# Altium schematic sheet MAIN.SchDoc
size OrCAD C
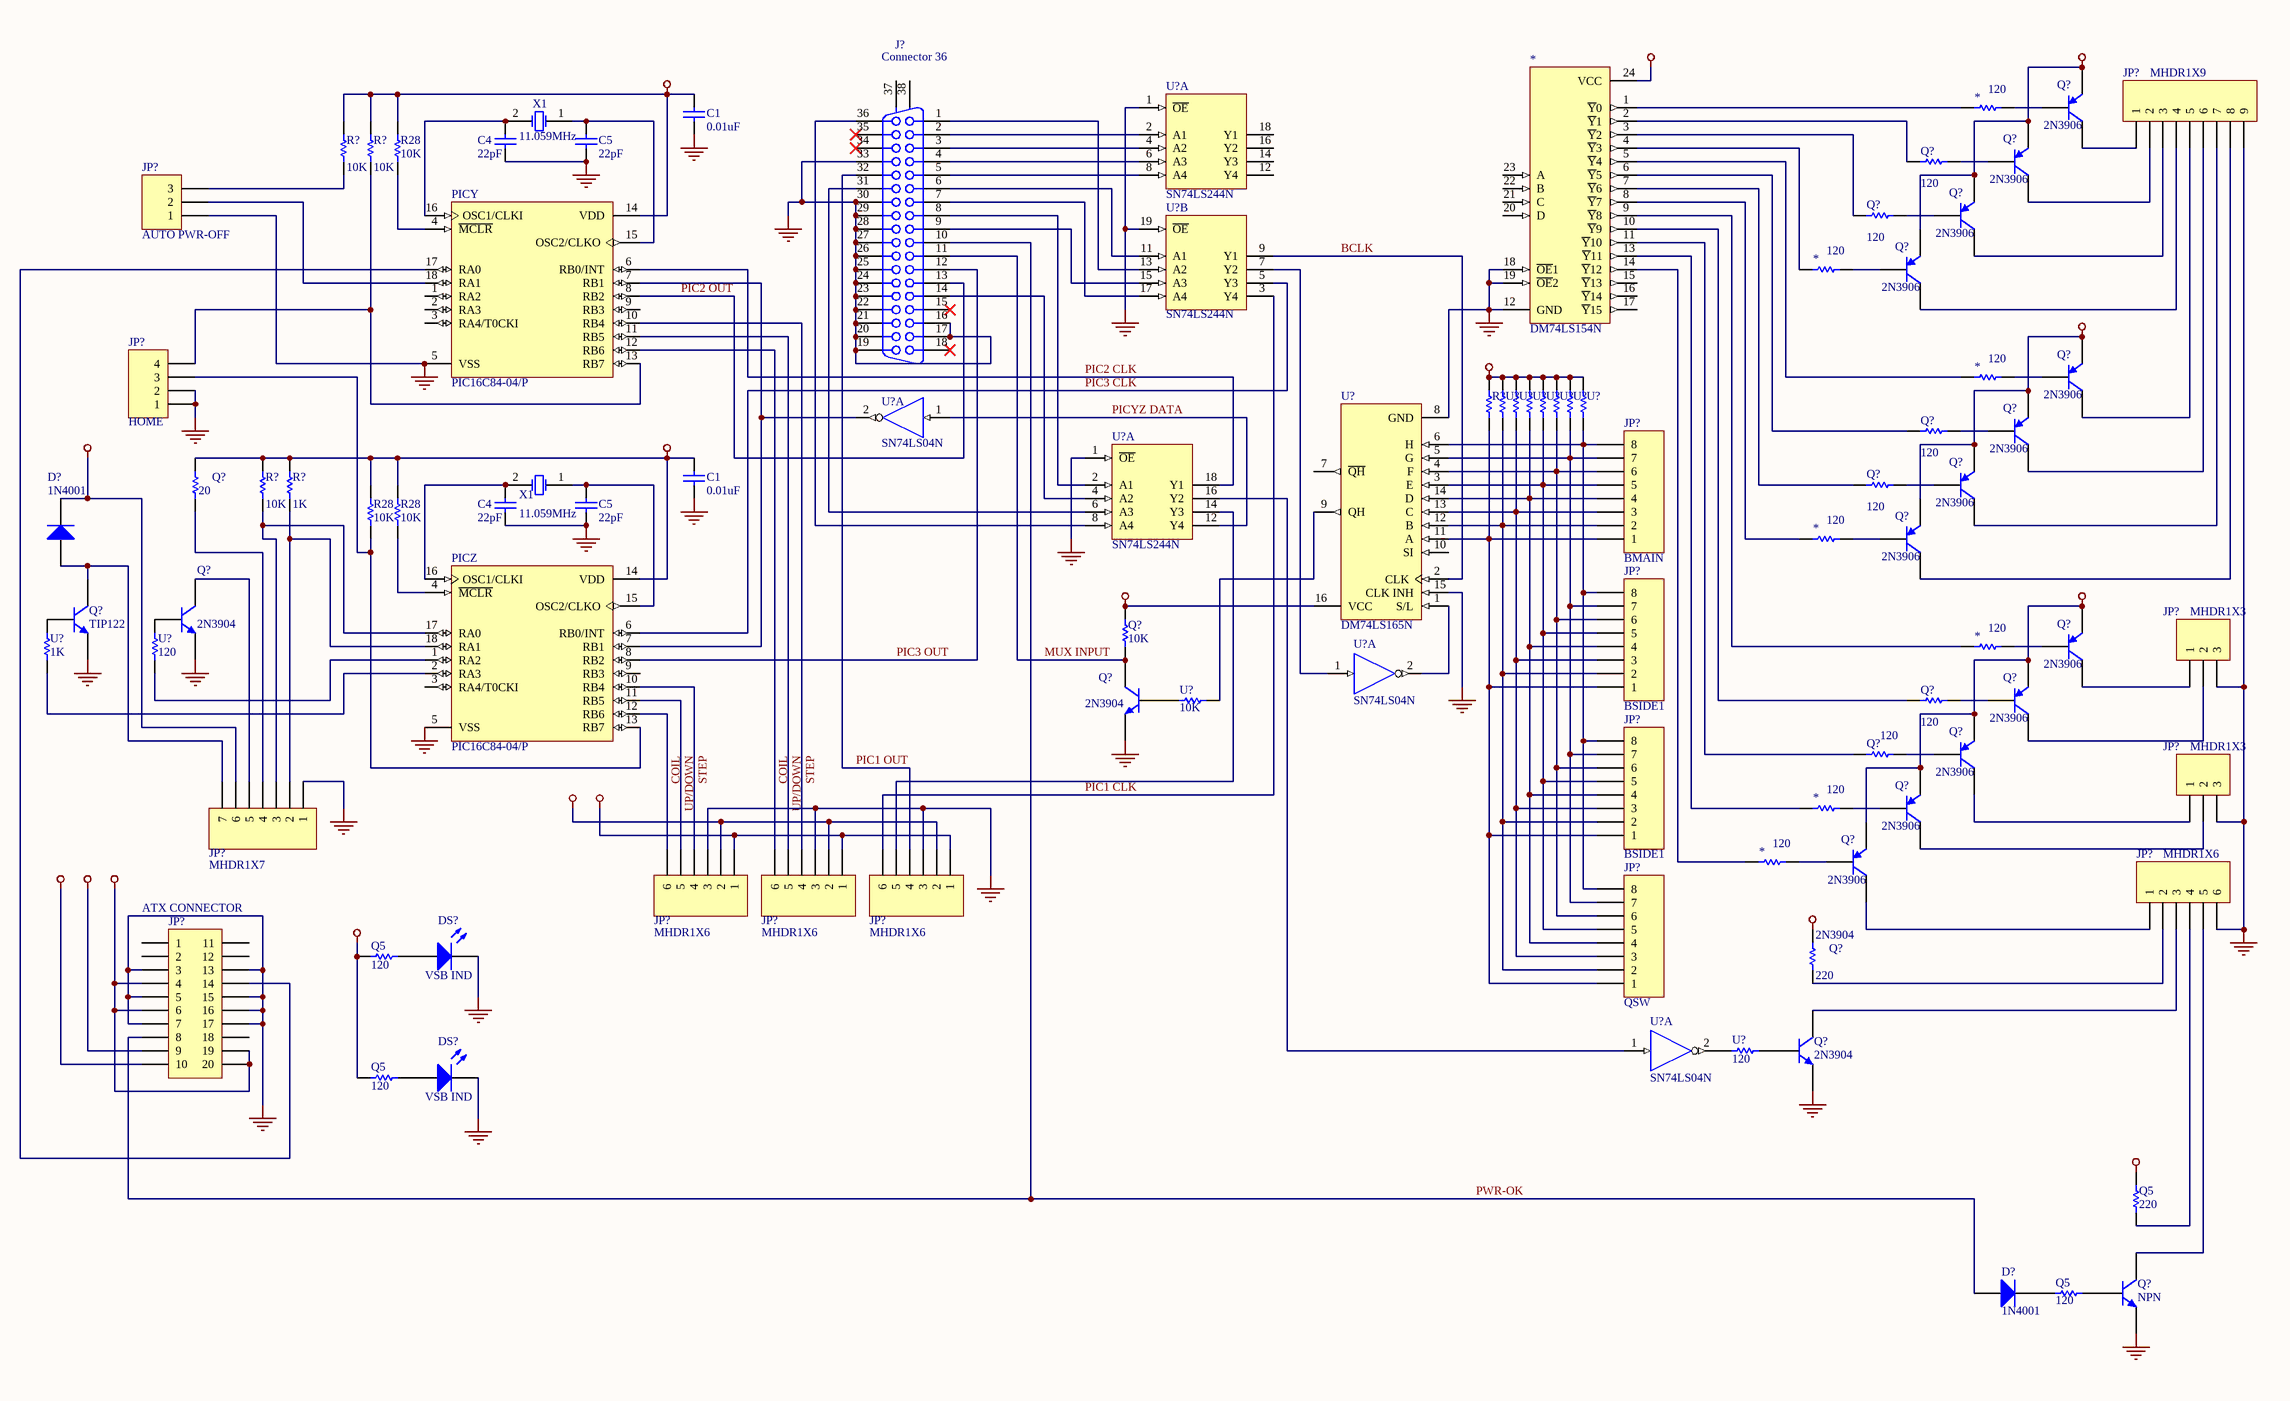
[diagram p0: MAIN.SchDoc]

## Parts
(Parts that share a designator on the sheet are numbered #1, #2 ... from top to bottom, then left to right.)
*#1  DM74LS154N  [DIP-16/X1.5]
*#2  value 120  [DIP-16/X1.5]  (hidden comment: SN74LS161AN)
*#3  value 120  [DIP-16/X1.5]  (hidden comment: SN74LS161AN)
*#4  value 120  [DIP-16/X1.5]  (hidden comment: SN74LS161AN)
*#5  value 120  [DIP-16/X1.5]  (hidden comment: SN74LS161AN)
*#6  value 120  [DIP-16/X1.5]  (hidden comment: SN74LS161AN)
*#7  value 120  [DIP-16/X1.5]  (hidden comment: SN74LS161AN)
*#8  value 120  [DIP-16/X1.5]  (hidden comment: SN74LS161AN)
C1#1  value 0.01uF  [RAD-0.3]
C1#2  value 0.01uF  [RAD-0.3]
C4#1  value 22pF  [C3216-1206]  (hidden comment: XTAL)
C4#2  value 22pF  [C3216-1206]  (hidden comment: XTAL)
C5#1  value 22pF  [C3216-1206]  (hidden comment: XTAL)
C5#2  value 22pF  [C3216-1206]  (hidden comment: XTAL)
D?#1  1N4001  [DIO10.46-5.3x2.8]
D?#2  1N4001  [DIO10.46-5.3x2.8]
DS?#1  VSB IND  [DSO-F2/D6.1]
DS?#2  VSB IND  [DSO-F2/D6.1]
J?  Connector 36  [CHAMP1.27-2H36]
JP?#1  MHDR1X9  [MHDR1X9]
JP?#2  AUTO PWR-OFF  [HDR1X3H]
JP?#3  HOME  [MHDR1X4]
JP?#4  BMAIN  [MHDR1X8]
JP?#5  MHDR1X3  [MHDR1X3]
JP?#6  BSIDE1  [MHDR1X8]
JP?#7  MHDR1X3  [MHDR1X3]
JP?#8  MHDR1X7  [MHDR1X7]
JP?#9  BSIDE1  [MHDR1X8]
JP?#10  MHDR1X6  [MHDR1X6]
JP?#11  MHDR1X6  [MHDR1X6]
JP?#12  MHDR1X6  [MHDR1X6]
JP?#13  MHDR1X6  [MHDR1X6]
JP?#14  ATX CONNECTOR  [HDR2X10_CEN]
JP?#15  QSW  [MHDR1X8]
PICY  PIC16C84-04/P  [DIP-18]
PICZ  PIC16C84-04/P  [DIP-18]
Q5#1  value 120  [SFM-T3/X1.6V]  (hidden comment: MJE15030)
Q5#2  value 120  [SFM-T3/X1.6V]  (hidden comment: MJE15030)
Q5#3  value 220  [SFM-T3/X1.6V]  (hidden comment: MJE15030)
Q5#4  value 120  [SFM-T3/X1.6V]  (hidden comment: MJE15030)
Q?#1  2N3906  [BCY-W3/D4.7]
Q?#2  value 120  [BCY-W3/D4.7]  (hidden comment: 2N3906)
Q?#3  2N3906  [BCY-W3/D4.7]
Q?#4  value 120  [BCY-W3/D4.7]  (hidden comment: 2N3906)
Q?#5  2N3906  [BCY-W3/D4.7]
Q?#6  2N3906  [BCY-W3/D4.7]
Q?#7  2N3906  [BCY-W3/D4.7]
Q?#8  value 120  [BCY-W3/D4.7]  (hidden comment: 2N3906)
Q?#9  2N3906  [BCY-W3/D4.7]
Q?#10  value 120  [BCY-W3/D4.7]  (hidden comment: 2N3906)
Q?#11  2N3906  [BCY-W3/D4.7]
Q?#12  value 20  [BCY-W3/D4.7]  (hidden comment: 2N3904)
Q?#13  2N3906  [BCY-W3/D4.7]
Q?#14  TIP122  [SFM-T3/X1.6V]
Q?#15  2N3904  [BCY-W3/D4.7]
Q?#16  2N3906  [BCY-W3/D4.7]
Q?#17  value 10K  [BCY-W3/D4.7]  (hidden comment: 2N3904)
Q?#18  2N3904  [BCY-W3/D4.7]
Q?#19  value 120  [BCY-W3/D4.7]  (hidden comment: 2N3906)
Q?#20  2N3906  [BCY-W3/D4.7]
Q?#21  value 120  [BCY-W3/D4.7]  (hidden comment: 2N3906)
Q?#22  2N3906  [BCY-W3/D4.7]
Q?#23  2N3906  [BCY-W3/D4.7]
Q?#24  2N3906  [BCY-W3/D4.7]
Q?#25  2N3904  value 220  [BCY-W3/D4.7]
Q?#26  2N3904  [BCY-W3/D4.7]
Q?#27  NPN  [BCY-W3]
R28#1  value 10K  [DIP-18]  (hidden comment: PIC16C84-04/P)
R28#2  value 10K  [DIP-18]  (hidden comment: PIC16C84-04/P)
R28#3  value 10K  [DIP-18]  (hidden comment: PIC16C84-04/P)
R?#1  value 10K  [AXIAL-0.7]  (hidden comment: Res Adj1)
R?#2  value 10K  [AXIAL-0.7]  (hidden comment: Res Adj1)
R?#3  10K  [SIP-P3]  (value not drawn)
R?#4  value 1K  [AXIAL-0.7]  (hidden comment: Res Adj1)
R?#5  value 10K  [AXIAL-0.7]  (hidden comment: Res Adj1)
U?#1  SN74LS244N  [DIP-20/E5.3]  (part A of 2)
U?#2  SN74LS244N  [DIP-20/E5.3]  (part B of 2)
U?#3  A3189SU  [SIP-P3]  (value not drawn)
U?#4  A3189SU  [SIP-P3]  (value not drawn)
U?#5  A3189SU  [SIP-P3]  (value not drawn)
U?#6  A3189SU  [SIP-P3]  (value not drawn)
U?#7  A3189SU  [SIP-P3]  (value not drawn)
U?#8  A3189SU  [SIP-P3]  (value not drawn)
U?#9  A3189SU  [SIP-P3]  (value not drawn)
U?#10  SN74LS04N  [DIP-14/D19.7]  (part A of 6)
U?#11  SN74LS244N  [DIP-20/E5.3]  (part A of 2)
U?#12  DM74LS165N  [CDFP-G16/E7]
U?#13  SN74LS04N  [DIP-14/D19.7]  (part A of 6)
U?#14  value 1K  [DIP-14/D19.7]  (hidden comment: SN74LS04N)
U?#15  value 120  [DIP-14/D19.7]  (hidden comment: SN74LS04N)
U?#16  value 10K  [CDFP-G16/E7]  (hidden comment: DM74LS165N)
U?#17  SN74LS04N  [DIP-14/D19.7]  (part A of 6)
U?#18  value 120  [DIP-14/D19.7]  (hidden comment: SN74LS04N)
X1#1  11.059MHz  [BCY-W2/D3.1]
X1#2  11.059MHz  [BCY-W2/D3.1]

## Nets
+12V: D?#1.2(K) JP?#8.6 JP?#10.1 JP?#11.1 JP?#12.1 JP?#14.10
GND: *#1.12(GND) *#1.18(~{OE}1) *#1.19(~{OE}2) C1#1.2 C1#2.2 C4#1.1 C4#2.1 C5#1.1 C5#2.1 DS?#1.2(K) DS?#2.2(K) J?.16 J?.17 J?.19 J?.20 J?.21 J?.22 J?.23 J?.24 J?.25 J?.26 J?.27 J?.28 J?.29 J?.30 J?.33 JP?#1.9 JP?#2.1 JP?#3.1 JP?#3.2 JP?#5.3 JP?#7.3 JP?#8.1 JP?#10.3 JP?#11.3 JP?#12.3 JP?#13.6 JP?#14.3 JP?#14.5 JP?#14.7 JP?#14.13 JP?#14.15 JP?#14.16 JP?#14.17 PICY.5(VSS) PICZ.5(VSS) Q?#14.3(E) Q?#15.1(E) Q?#18.1(E) Q?#26.1(E) Q?#27.3(E) U?#1.1(~{OE}) U?#1.10(GND) U?#2.10(GND) U?#2.19(~{OE}) U?#10.7(GND) U?#11.1(~{OE}) U?#11.10(GND) U?#12.8(GND) U?#12.15(CLK_INH) U?#13.7(GND) U?#17.7(GND)
VDD: *#1.24(VCC) C1#2.1 JP?#10.2 JP?#11.2 JP?#12.2 JP?#14.4 JP?#14.6 JP?#14.19 JP?#14.20 PICZ.14(VDD) Q?#1.1(E) Q?#3.1(E) Q?#5.1(E) Q?#6.1(E) Q?#7.1(E) Q?#9.1(E) Q?#11.1(E) Q?#12.2 Q?#13.1(E) Q?#16.1(E) Q?#17.2 Q?#20.1(E) Q?#22.1(E) Q?#23.1(E) Q?#24.1(E) Q?#25.2 R28#2.2 R28#3.2 R?#3.2 R?#4.1 R?#5.2 U?#1.20(VDD) U?#2.20(VDD) U?#3.2 U?#4.2 U?#5.2 U?#6.2 U?#7.2 U?#8.2 U?#9.2 U?#10.14(VDD) U?#11.20(VDD) U?#12.16(VCC) U?#13.14(VDD) U?#17.14(VDD)
VSB: C1#1.1 JP?#14.9 PICY.14(VDD) Q5#1.1 Q5#2.1 Q5#3.1 R28#1.2 R?#1.1 R?#2.1
BCLK: U?#2.9(Y1) U?#12.2(CLK)
COIL: JP?#10.6 JP?#11.6 PICY.12(RB6) PICZ.12(RB6)
MUX INPUT: J?.11 Q?#17.1 Q?#18.3(C)
PIC1 CLK: JP?#12.6 U?#2.3(Y4)
PIC1 OUT: J?.32 JP?#12.4
PIC2 CLK: PICY.6(RB0/INT) U?#11.18(Y1)
PIC2 OUT: J?.13 PICY.8(RB2)
PIC3 CLK: PICZ.6(RB0/INT) U?#2.5(Y3)
PIC3 OUT: J?.12 PICZ.8(RB2)
PICYZ DATA: U?#10.1(IN) U?#11.12(Y4)
PWR-OK: D?#2.1(A) J?.10 JP?#14.8
STEP: JP?#10.4 JP?#11.4 PICY.10(RB4) PICZ.10(RB4)
UP/DOWN: JP?#10.5 JP?#11.5 PICY.11(RB5) PICZ.11(RB5)
Net*#1_1: *#1.1(~{Y}0) *#2.1
Net*#1_2: *#1.2(~{Y}1) Q?#2.1
Net*#1_3: *#1.3(~{Y}2) Q?#4.1
Net*#1_4: *#1.4(~{Y}3) *#3.1
Net*#1_5: *#1.5(~{Y}4) *#4.1
Net*#1_6: *#1.6(~{Y}5) Q?#8.1
Net*#1_7: *#1.7(~{Y}6) Q?#10.1
Net*#1_8: *#1.8(~{Y}7) *#5.1
Net*#1_9: *#1.9(~{Y}8) *#6.1
Net*#1_10: *#1.10(~{Y}9) Q?#19.1
Net*#1_11: *#1.11(~{Y}10) Q?#21.1
Net*#1_13: *#1.13(~{Y}11) *#7.1
Net*#1_14: *#1.14(~{Y}12) *#8.1
Net*#2_2: *#2.2 Q?#1.2(B)
Net*#3_2: *#3.2 Q?#6.2(B)
Net*#4_2: *#4.2 Q?#7.2(B)
Net*#5_2: *#5.2 Q?#13.2(B)
Net*#6_2: *#6.2 Q?#16.2(B)
Net*#7_2: *#7.2 Q?#23.2(B)
Net*#8_2: *#8.2 Q?#24.2(B)
NetC4#1_2: C4#1.2 PICY.16(OSC1/CLKI) X1#1.2(OSC2)
NetC4#2_2: C4#2.2 PICZ.16(OSC1/CLKI) X1#2.2(OSC2)
NetC5#1_2: C5#1.2 PICY.15(OSC2/CLKO) X1#1.1(OSC1)
NetC5#2_2: C5#2.2 PICZ.15(OSC2/CLKO) X1#2.1(OSC1)
NetD?#1_1: D?#1.1(A) JP?#8.7 Q?#14.2(C)
NetD?#2_2: D?#2.2(K) Q5#4.1
NetDS?#1_1: DS?#1.1(A) Q5#1.2
NetDS?#2_1: DS?#2.1(A) Q5#2.2
NetJ?_1: J?.1 U?#2.13(A2)
NetJ?_2: J?.2 U?#1.2(A1)
NetJ?_3: J?.3 U?#1.4(A2)
NetJ?_4: J?.4 U?#1.6(A3)
NetJ?_5: J?.5 U?#1.8(A4)
NetJ?_6: J?.6 U?#2.11(A1)
NetJ?_7: J?.7 U?#2.17(A4)
NetJ?_8: J?.8 U?#11.2(A1)
NetJ?_9: J?.9 U?#2.15(A3)
NetJ?_14: J?.14 U?#11.4(A2)
NetJ?_31: J?.31 U?#11.6(A3)
NetJ?_36: J?.36 U?#11.8(A4)
NetJP?#1_1: JP?#1.1 Q?#1.3(C)
NetJP?#1_2: JP?#1.2 Q?#3.3(C)
NetJP?#1_3: JP?#1.3 Q?#5.3(C)
NetJP?#1_4: JP?#1.4 Q?#6.3(C)
NetJP?#1_5: JP?#1.5 Q?#7.3(C)
NetJP?#1_6: JP?#1.6 Q?#9.3(C)
NetJP?#1_7: JP?#1.7 Q?#11.3(C)
NetJP?#1_8: JP?#1.8 Q?#13.3(C)
NetJP?#2_2: JP?#2.2 PICY.18(RA1)
NetJP?#2_3: JP?#2.3 R?#1.2
NetJP?#3_3: JP?#3.3 PICZ.13(RB7) R28#2.1
NetJP?#3_4: JP?#3.4 PICY.13(RB7) R?#2.2
NetJP?#4_1: JP?#4.1 JP?#6.1 JP?#9.1 JP?#15.1 R?#3.1 U?#12.11(A)
NetJP?#4_2: JP?#4.2 JP?#6.2 JP?#9.2 JP?#15.2 U?#3.1 U?#12.12(B)
NetJP?#4_3: JP?#4.3 JP?#6.3 JP?#9.3 JP?#15.3 U?#4.1 U?#12.13(C)
NetJP?#4_4: JP?#4.4 JP?#6.4 JP?#9.4 JP?#15.4 U?#5.1 U?#12.14(D)
NetJP?#4_5: JP?#4.5 JP?#6.5 JP?#9.5 JP?#15.5 U?#6.1 U?#12.3(E)
NetJP?#4_6: JP?#4.6 JP?#6.6 JP?#9.6 JP?#15.6 U?#7.1 U?#12.4(F)
NetJP?#4_7: JP?#4.7 JP?#6.7 JP?#9.7 JP?#15.7 U?#8.1 U?#12.5(G)
NetJP?#4_8: JP?#4.8 JP?#6.8 JP?#9.8 JP?#15.8 U?#9.1 U?#12.6(H)
NetJP?#5_1: JP?#5.1 Q?#16.3(C)
NetJP?#5_2: JP?#5.2 Q?#20.3(C)
NetJP?#7_1: JP?#7.1 Q?#22.3(C)
NetJP?#7_2: JP?#7.2 Q?#23.3(C)
NetJP?#8_2: JP?#8.2 PICZ.18(RA1) R?#4.2
NetJP?#8_3: JP?#8.3 PICZ.17(RA0) R?#5.1
NetJP?#8_4: JP?#8.4 Q?#12.1
NetJP?#8_5: JP?#8.5 Q?#15.3(C)
NetJP?#12_5: JP?#12.5 U?#11.14(Y3)
NetJP?#13_1: JP?#13.1 Q?#24.3(C)
NetJP?#13_2: JP?#13.2 Q?#25.1
NetJP?#13_3: JP?#13.3 Q?#26.3(C)
NetJP?#13_4: JP?#13.4 Q5#3.2
NetJP?#13_5: JP?#13.5 Q?#27.1(C)
NetJP?#14_14: JP?#14.14 PICY.17(RA0)
NetPICY_4: PICY.4(~{MCLR}) R28#1.1
NetPICY_7: PICY.7(RB1) PICZ.7(RB1) U?#10.2(~{OUT})
NetPICZ_1: PICZ.1(RA2) U?#15.1
NetPICZ_2: PICZ.2(RA3) U?#14.1
NetPICZ_4: PICZ.4(~{MCLR}) R28#3.1
NetQ5#4_2: Q5#4.2 Q?#27.2(B)
NetQ?#2_2: Q?#2.2 Q?#3.2(B)
NetQ?#4_2: Q?#4.2 Q?#5.2(B)
NetQ?#8_2: Q?#8.2 Q?#9.2(B)
NetQ?#10_2: Q?#10.2 Q?#11.2(B)
NetQ?#14_1: Q?#14.1(B) U?#14.2
NetQ?#15_2: Q?#15.2(B) U?#15.2
NetQ?#18_2: Q?#18.2(B) U?#16.1
NetQ?#19_2: Q?#19.2 Q?#20.2(B)
NetQ?#21_2: Q?#21.2 Q?#22.2(B)
NetQ?#26_2: Q?#26.2(B) U?#18.2
NetU?#2_7: U?#2.7(Y2) U?#13.1(IN)
NetU?#11_16: U?#11.16(Y2) U?#17.1(IN)
NetU?#12_1: U?#12.1(S/L) U?#13.2(~{OUT})
NetU?#12_9: U?#12.9(QH) U?#16.2
NetU?#17_2: U?#17.2(~{OUT}) U?#18.1

Not connected (* = marked no-connect by the designer): *#1 15(~{Y}13) 16(~{Y}14) 17(~{Y}15) 20(D) 21(C) 22(B) 23(A); J? 15* 18* 34* 35* 37(MH1) 38(MH2); JP?#14 1 2 11 12 18; PICY 1(RA2) 2(RA3) 3(RA4/T0CKI) 9(RB3); PICZ 3(RA4/T0CKI) 9(RB3); U?#1 12(Y4) 14(Y3) 16(Y2) 18(Y1); U?#12 7(~{QH}) 10(SI)

## Library data of the parts
*#1 = DM74LS154N: 4-Line to 16-Line Decoder/Demultiplexer; Manufacturer: Fairchild Semiconductor; Class I: Logic; Note: Generic Simulation model provided.; Published: 15-Apr-2002; Datasheet: Latest Revision: Mar-1998; Package Reference: N24A; Publisher: Altium Limited; Class II: Decoder/Demultiplexer
*#2-*#8 R28#1-R28#3 U?#16 = res1: Resistor; Manufacturer: Generic Components; Class I: Passive; Published: 8-Jun-2000; Revision: July-2002: Re-released for DXP Platform.; Publisher: Altium Limited; Class II: Resistor
C1#1 C1#2 = Cap: Capacitor; Manufacturer: Generic Components; Class I: Passive; Published: 8-Jun-2000; Revision: July-2002: Re-released for DXP Platform.; Publisher: Altium Limited; Class II: Capacitor
C4#1 C4#2 C5#1 C5#2 = cap: Capacitor; Manufacturer: Generic Components; Class I: Passive; Published: 8-Jun-2000; Revision: July-2002: Re-released for DXP Platform.; Publisher: Altium Limited; Class II: Capacitor
D?#1 D?#2 = 1N4001: 1.0 Ampere General Purpose Rectifier; Manufacturer: Fairchild Semiconductor; Revision 1: 11-July-2000: SIM Model Added.; Revision 2: July-2002: Re-released for DXP Platform.; Package Information: Latest Revision: Aug-1999; Class I: Discrete; Class II: Rectifier - Standard Recovery; Published: 8-Jun-2000; Datasheet: Latest Revision: 1998; Package Reference: DO-41; Publisher: Altium Limited
DS?#1 DS?#2 = LED2: Typical RED, GREEN, YELLOW, AMBER GaAs LED; Manufacturer: Generic Components; Class I: Optoelectronic; Published: 8-Jun-2000; Revision: July-2002: Re-released for DXP Platform.; Publisher: Altium Limited; Class II: LED
J? = Connector 36: Receptacle Header Assemby; Manufacturer: Generic Components; Package Information: Latest Revision: B; Positions: 36; Published: 15-Jun-2001; Revision: July-2002: Re-released for DXP Platform.; Datasheet: (1-Oct-1983); Package Reference: 178240; Publisher: Altium Limited; Class I: Connector; Orientation: Right Angle
JP?#1 = MHDR1X9: Header, 9-Pin; Manufacturer: Generic Components; Class I: Connector; Revision: July-2002: Re-released for DXP Platform.; Publisher: Altium Limited
JP?#2 = Header 3H: Header, 3-Pin,  Right Angle; Manufacturer: Generic Components; Class I: Connector; Revision: July-2002: Re-released for DXP Platform.; Publisher: Altium Limited
JP?#3 = MHDR1X4: Header, 4-Pin; Manufacturer: Generic Components; Class I: Connector; Revision: July-2002: Re-released for DXP Platform.; Publisher: Altium Limited
JP?#4 JP?#6 JP?#9 JP?#15 = MHDR1X8: Header, 8-Pin; Manufacturer: Generic Components; Class I: Connector; Revision: July-2002: Re-released for DXP Platform.; Publisher: Altium Limited
JP?#5 JP?#7 = MHDR1X3: Header, 3-Pin; Manufacturer: Generic Components; Class I: Connector; Revision: July-2002: Re-released for DXP Platform.; Publisher: Altium Limited
JP?#8 = MHDR1X7: Header, 7-Pin; Manufacturer: Generic Components; Class I: Connector; Revision: July-2002: Re-released for DXP Platform.; Publisher: Altium Limited
JP?#10-JP?#13 = MHDR1X6: Header, 6-Pin; Manufacturer: Generic Components; Class I: Connector; Revision: July-2002: Re-released for DXP Platform.; Publisher: Altium Limited
JP?#14 = Header 10X2A: Header, 10-Pin, Dual row; Manufacturer: Generic Components; Revision: July-2002: Re-released for DXP Platform.; Publisher: Altium Limited; Class I: Connector
PICY PICZ = PIC16C84-04/P: EPROM-Based 8-Bit CMOS Microcontroller; Manufacturer: Microchip; Published: 8-Jun-2000; Revision: July-2002: Re-released for DXP Platform.; Datasheet: 1997 Technical Library CD (1996); Package Reference: P18A; Publisher: Altium Limited; Class I: Microcontroller; Class II: 8-bit
Q5#1-Q5#4 Q?#2 Q?#4 Q?#8 Q?#10 Q?#12 Q?#17 Q?#19 Q?#21 Q?#25 R?#1-R?#5 U?#3-U?#9 U?#14 U?#15 U?#18 = RES1: Resistor; Manufacturer: Generic Components; Class I: Passive; Published: 8-Jun-2000; Revision: July-2002: Re-released for DXP Platform.; Publisher: Altium Limited; Class II: Resistor
Q?#1 Q?#3 Q?#5-Q?#7 Q?#9 Q?#11 Q?#13 Q?#16 Q?#20 Q?#22-Q?#24 = 2N3906: PNP General Purpose Amplifier; Manufacturer: Generic Components; Revision 1: 11-July-2000: SIM Model Added.; Revision 2: July-2002: Re-released for DXP Platform.; Class I: Discrete; Class II: BJT - Low Power; Published: 8-Jun-2000; Datasheet: Latest Revision: 1997; Package Reference: TO-92A; Publisher: Altium Limited
Q?#14 = MJE15030: Complementary Silicon Plastic Power Transistor; Manufacturer: Motorola; Package Information: Latest Revision: 1997; Class I: Discrete; Class II: BJT - Medium Power; Note: Pin 2 is electrically connected to Pin 4 (TAB); Published: 29-Sep-2000; Revision: July-2002: Re-released for DXP Platform.; Datasheet: Latest Revision: 1995; Package Reference: 221A-06; Publisher: Altium Limited
Q?#15 Q?#18 Q?#26 = 2N3904: NPN General Purpose Amplifier; Manufacturer: Generic Components; Revision 1: 11-July-2000: SIM Model Added.; Revision 2: July-2002: Re-released for DXP Platform.; Class I: Discrete; Class II: BJT - Low Power; Published: 8-Jun-2000; Datasheet: Latest Revision: 1997; Package Reference: TO-92A; Publisher: Altium Limited
Q?#27 = NPN: NPN Bipolar Transistor; Manufacturer: Generic Components; Class I: Discrete; Class II: BJT - Low Power; Published: 8-Jun-2000; Revision: July-2002: Re-released for DXP Platform.; Publisher: Altium Limited
U?#1 U?#2 U?#11 = SN74LS244N: Octal Buffer/Line Driver with 3-State Outputs; Manufacturer: ON Semiconductor; Class I: Logic; Published: 15-Apr-2002; Package Reference: 738-03; Publisher: Altium Limited; Class II: Buffer/Line Driver
U?#10 U?#13 U?#17 = SN74LS04N: Hex Inverter; Manufacturer: ON Semiconductor; Class I: Logic; Class II: Buffer/Line Driver; Published: 15-Apr-2002; Datasheet: Latest Revision: 1999; Package Reference: 646-06; Publisher: Altium Limited
U?#12 = DM74LS165N: 8-Bit Parallel In/Serial Output Shift Register; Manufacturer: Fairchild Semiconductor; Package Information: Latest Revision: 2000; Class I: Logic; Note: Generic simulation model provided.; Published: 15-Apr-2002; Datasheet: Latest Revision: Apr-1998; Package Reference: W16A; Publisher: Altium Limited; Class II: Register
X1#1 X1#2 = XTAL: Crystal Oscillator; Manufacturer: Generic Components; Published: 8-Jun-2000; Revision: July-2002: Re-released for DXP Platform.; Publisher: Altium Limited; Class I: Oscillator; Class II: Crystal Oscillator